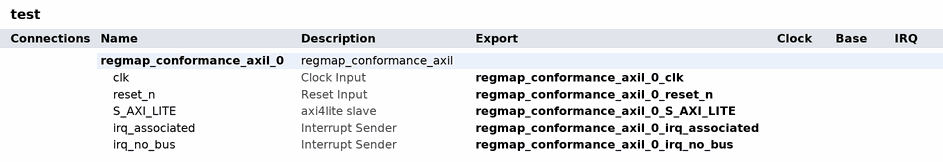
[diagram p0: system contents]
# Platform Designer (Qsys) system test
# Parameters at their usual value, and those the tool derives, are not listed.
package require qsys
create_system test

add_instance regmap_conformance_axil_0 regmap_conformance_axil 1.0.0

# exported interfaces
add_interface regmap_conformance_axil_0_clk clock sink
set_interface_property regmap_conformance_axil_0_clk EXPORT_OF regmap_conformance_axil_0.clk
add_interface regmap_conformance_axil_0_reset_n reset sink
set_interface_property regmap_conformance_axil_0_reset_n EXPORT_OF regmap_conformance_axil_0.reset_n
add_interface regmap_conformance_axil_0_S_AXI_LITE axi4lite slave
set_interface_property regmap_conformance_axil_0_S_AXI_LITE EXPORT_OF regmap_conformance_axil_0.S_AXI_LITE
add_interface regmap_conformance_axil_0_irq_associated interrupt sender
set_interface_property regmap_conformance_axil_0_irq_associated EXPORT_OF regmap_conformance_axil_0.irq_associated
add_interface regmap_conformance_axil_0_irq_no_bus interrupt sender
set_interface_property regmap_conformance_axil_0_irq_no_bus EXPORT_OF regmap_conformance_axil_0.irq_no_bus

save_system test.qsys
